# Altium schematic sheet Archive.SchDoc: Controller Interface Board
size A4; DrawnBy: Yan To Chau; SheetNumber: 1; SheetTotal: 1
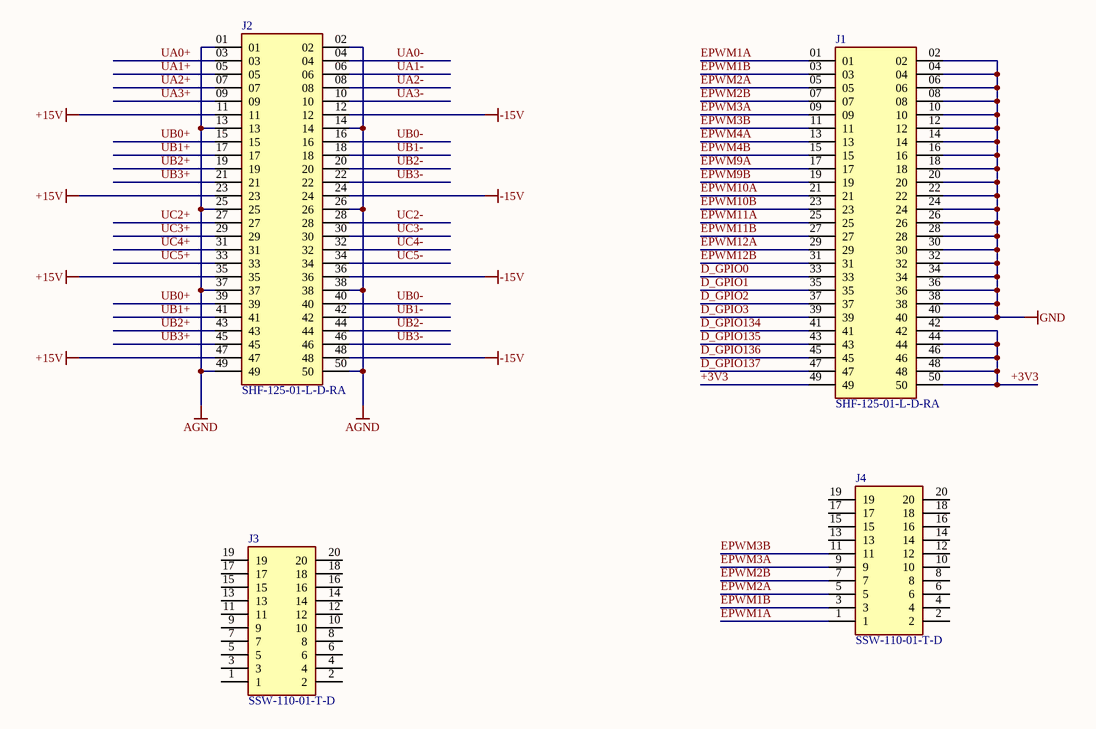
[diagram p0: Archive.SchDoc]

## Parts
J1  SHF-125-01-L-D-RA  [SAMTEC_SHF-125-01-L-D-RA]
J2  SHF-125-01-L-D-RA  [SAMTEC_SHF-125-01-L-D-RA]
J3  SSW-110-01-T-D  [SAMTEC_SSW-110-01-T-D]
J4  SSW-110-01-T-D  [SAMTEC_SSW-110-01-T-D]

## Nets
+15V: J2.11 J2.23 J2.35 J2.47
-15V: J2.12 J2.24 J2.36 J2.48
AGND: J2.01 J2.02 J2.13 J2.14 J2.25 J2.26 J2.37 J2.38 J2.49 J2.50
GND: J1.02 J1.04 J1.06 J1.08 J1.10 J1.12 J1.14 J1.16 J1.18 J1.20 J1.22 J1.24 J1.26 J1.28 J1.30 J1.32 J1.34 J1.36 J1.38 J1.40
+3V3: J1.42 J1.44 J1.46 J1.48 J1.49 J1.50
D_GPIO0: J1.33
D_GPIO1: J1.35
D_GPIO2: J1.37
D_GPIO3: J1.39
D_GPIO134: J1.41
D_GPIO135: J1.43
D_GPIO136: J1.45
D_GPIO137: J1.47
EPWM1A: J1.01 J4.1
EPWM1B: J1.03 J4.3
EPWM2A: J1.05 J4.5
EPWM2B: J1.07 J4.7
EPWM3A: J1.09 J4.9
EPWM3B: J1.11 J4.11
EPWM4A: J1.13
EPWM4B: J1.15
EPWM9A: J1.17
EPWM9B: J1.19
EPWM10A: J1.21
EPWM10B: J1.23
EPWM11A: J1.25
EPWM11B: J1.27
EPWM12A: J1.29
EPWM12B: J1.31
UA0+: J2.03
UA0-: J2.04
UA1+: J2.05
UA1-: J2.06
UA2+: J2.07
UA2-: J2.08
UA3+: J2.09
UA3-: J2.10
UB0+: J2.15 J2.39
UB0-: J2.16 J2.40
UB1+: J2.17 J2.41
UB1-: J2.18 J2.42
UB2+: J2.19 J2.43
UB2-: J2.20 J2.44
UB3+: J2.21 J2.45
UB3-: J2.22 J2.46
UC2+: J2.27
UC2-: J2.28
UC3+: J2.29
UC3-: J2.30
UC4+: J2.31
UC4-: J2.32
UC5+: J2.33
UC5-: J2.34

Not connected (* = marked no-connect by the designer): J3 1 2 3 4 5 6 7 8 9 10 11 12 13 14 15 16 17 18 19 20; J4 2 4 6 8 10 12 13 14 15 16 17 18 19 20

## Library data of the parts
J1 J2 = SHF-125-01-L-D-RA: MF: Samtec; MP: SHF-125-01-L-D-RA; Package: None; Price: None; Availability: Unavailable; Value: *
J3 J4 = SSW-110-01-T-D: Connector; Manufacturer_Name: SAMTEC; Datasheet Link: http://suddendocs.samtec.com/prints/ssw-1xx-xx-xxx-x-xx-xxx-xx-mkt.pdf; Manufacturer_Part_Number: SSW-110-01-T-D; Mouser Part Number: 200-SSW11001TD; Mouser Price/Stock: https://www.mouser.co.uk/ProductDetail/Samtec/SSW-110-01-T-D?qs=rkdpAy2aP%2F9uJOQW5acCOw%3D%3D; Arrow Part Number: SSW-110-01-T-D; Arrow Price/Stock: https://www.arrow.com/en/products/ssw-110-01-t-d/samtec?region=nac